# Altium project RC-XD(SRX).PrjPcb
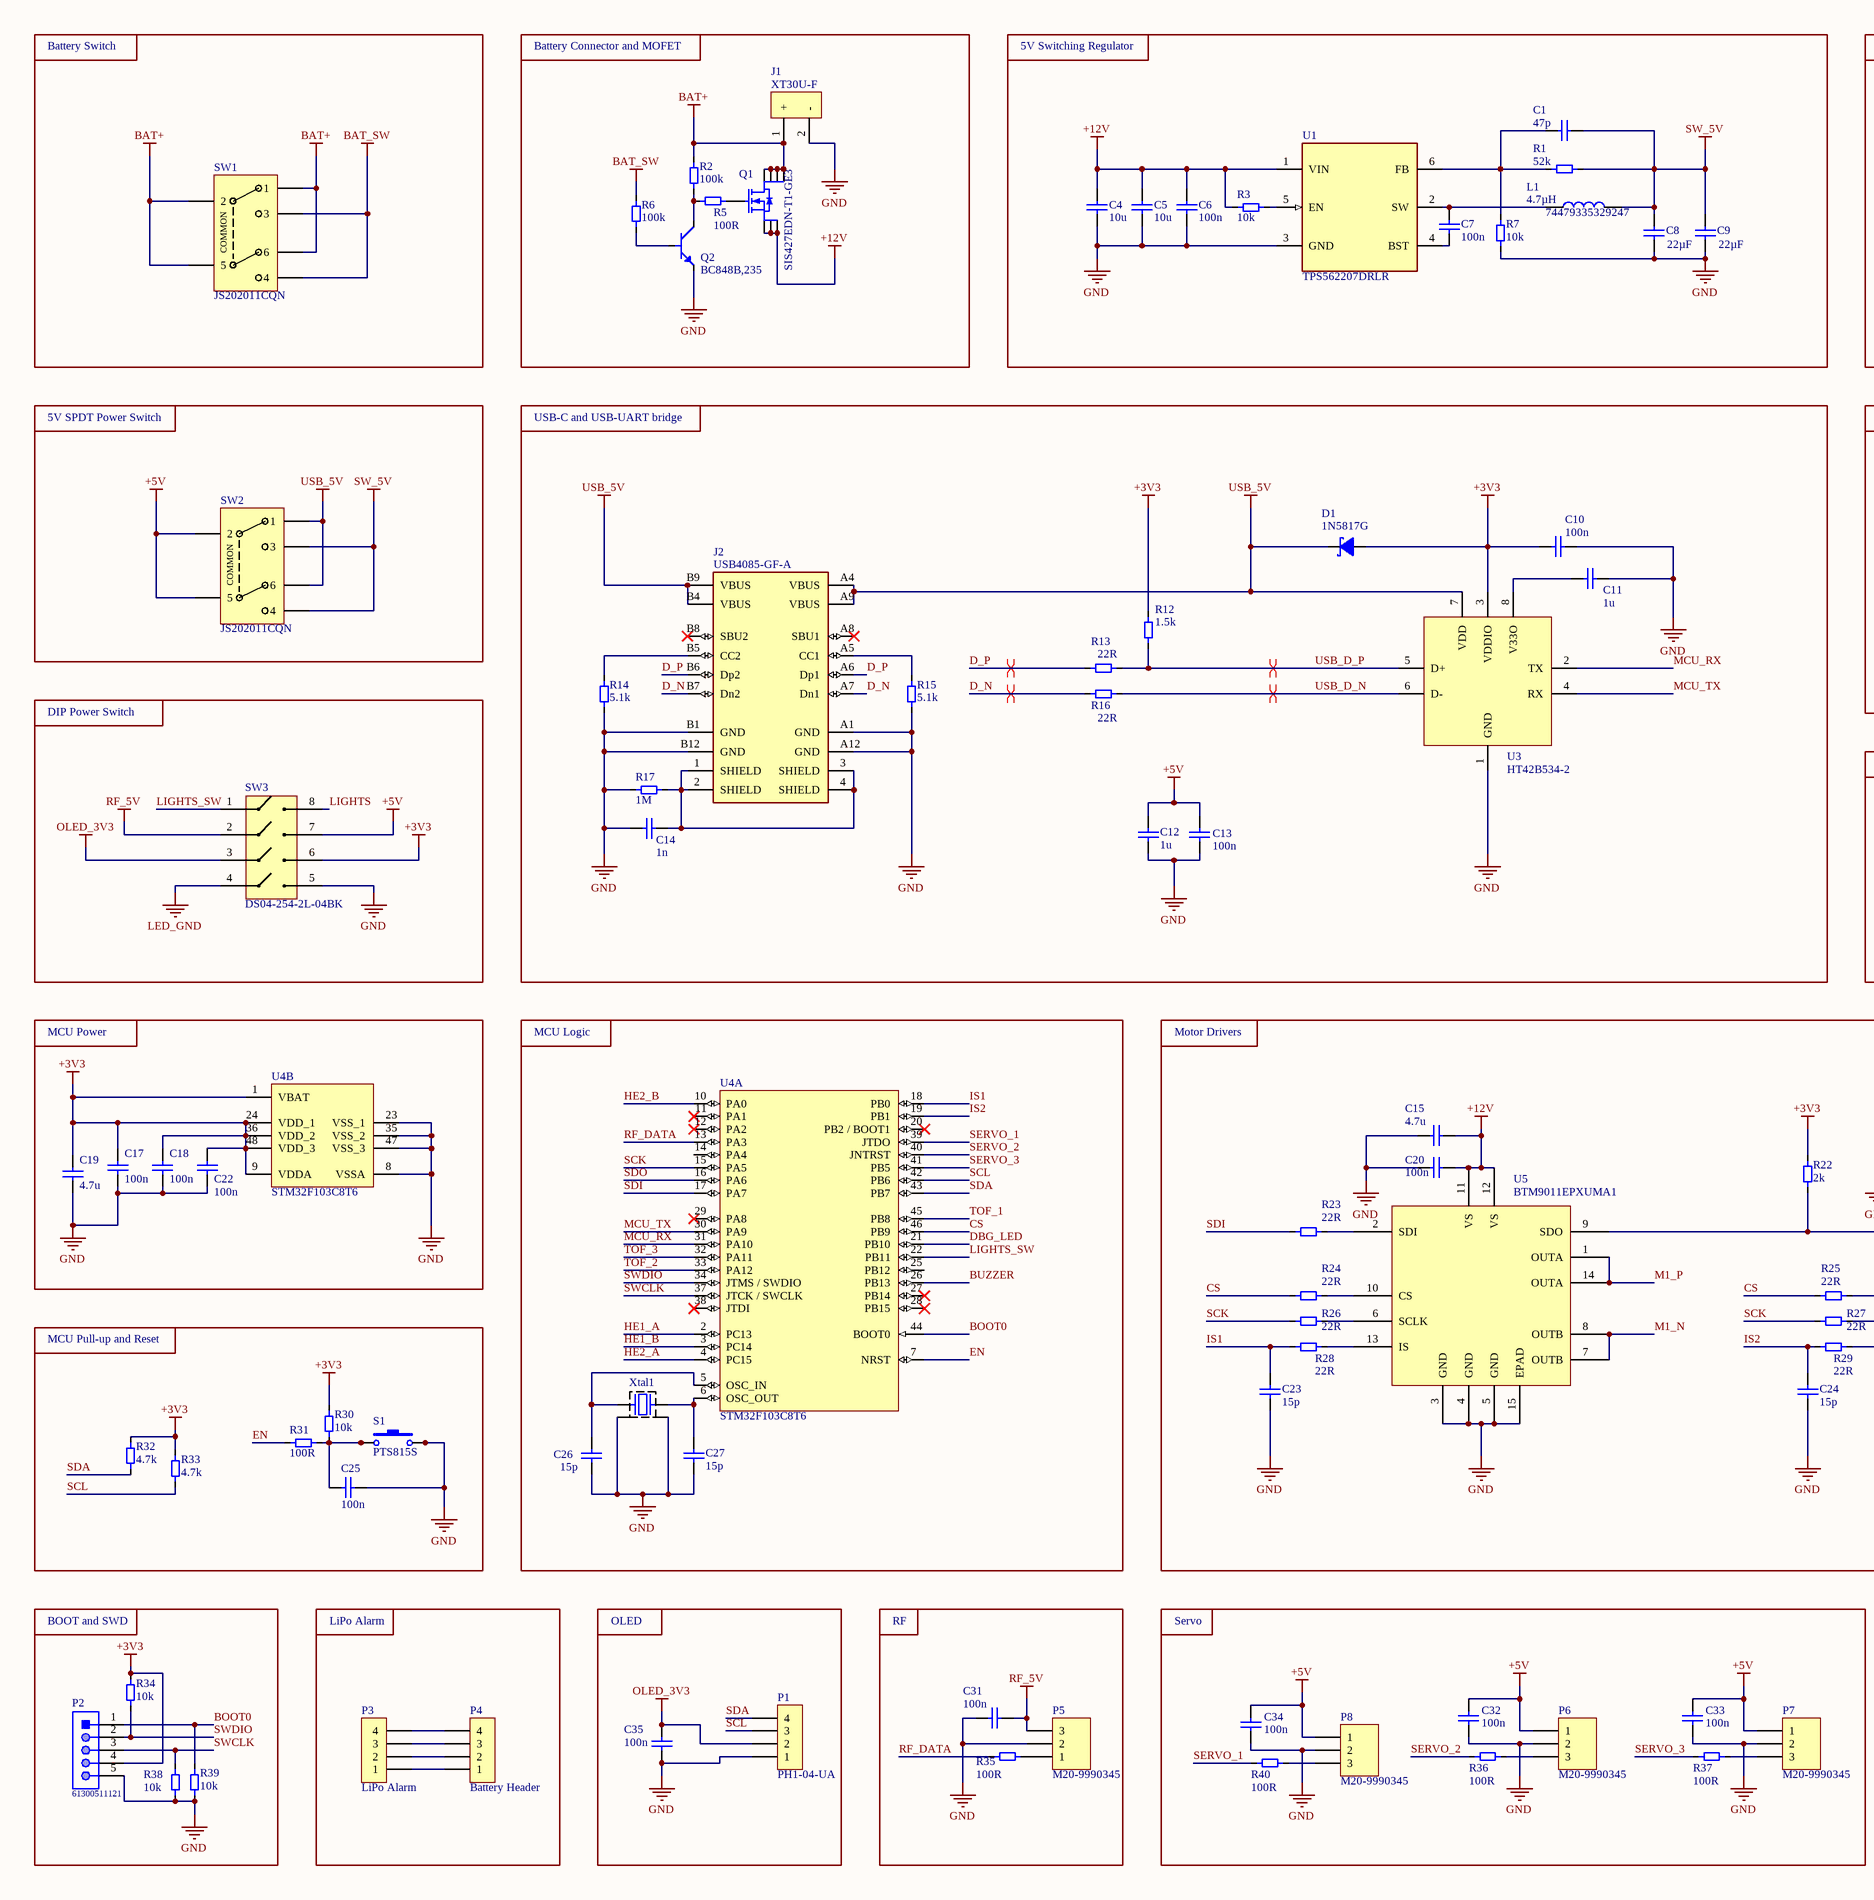
[diagram p0: SRX.SchDoc, left]
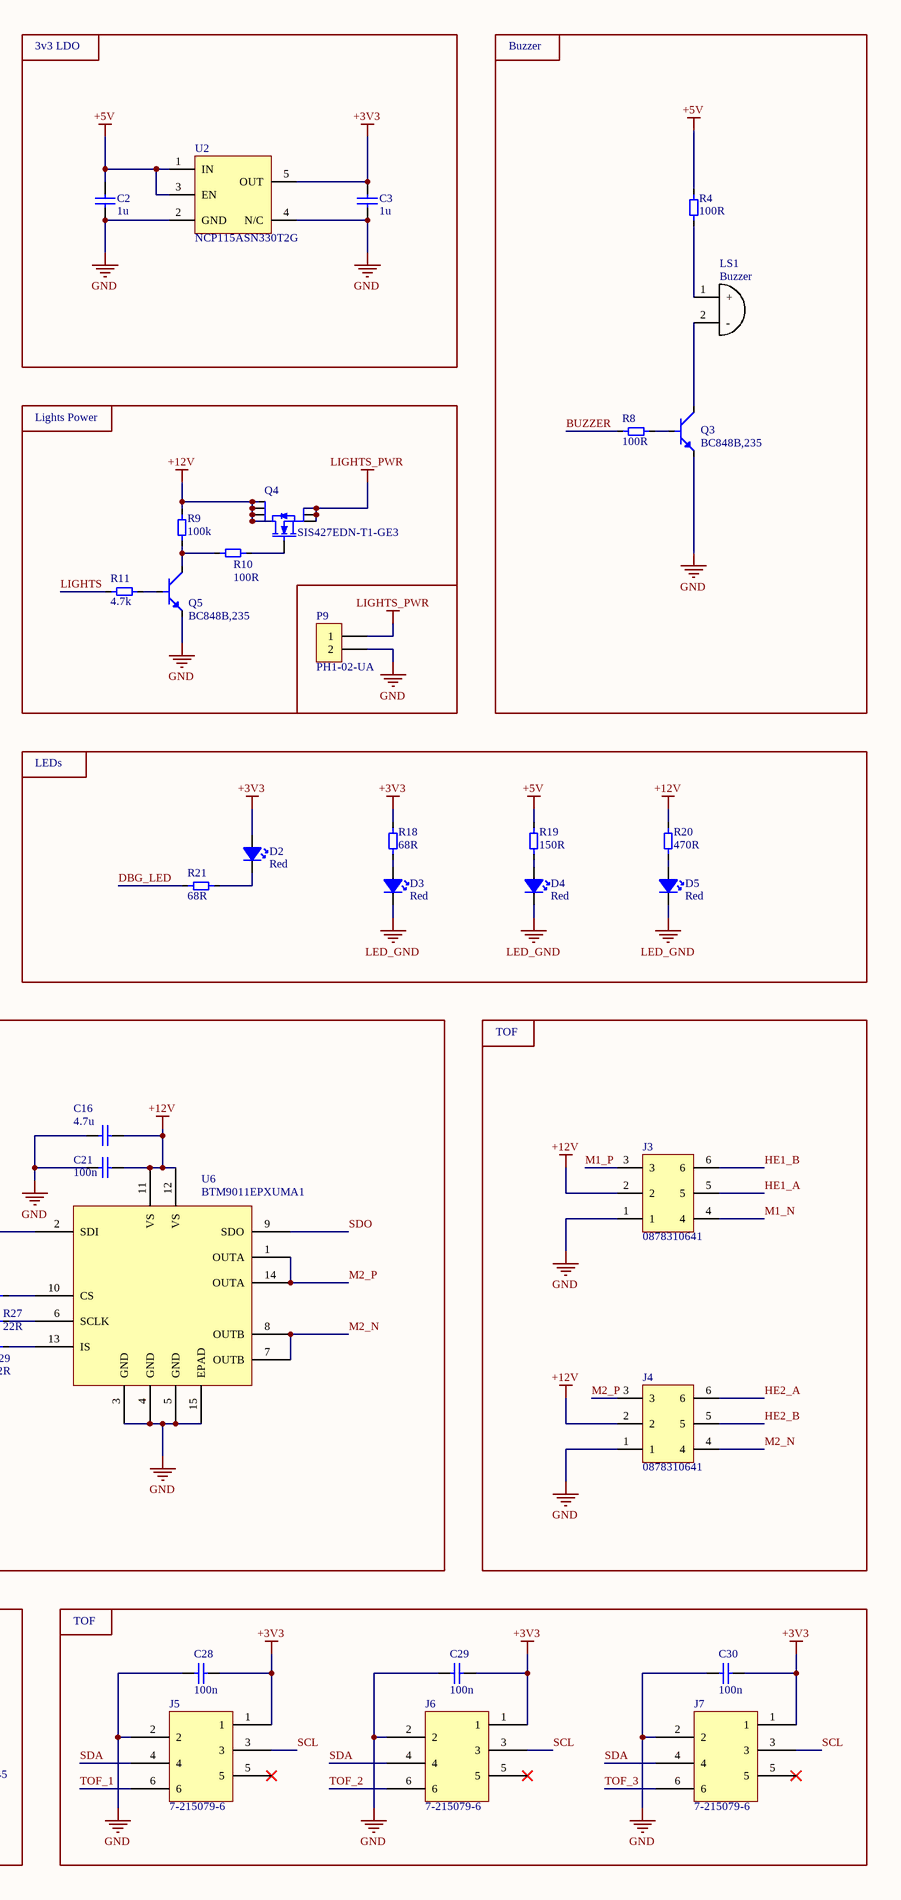
[diagram p1: SRX.SchDoc, right]
1 sheet, 114 parts. Net scope: global (net labels, ports and power ports of the same name join across sheets).
Board file: SRX.PcbDoc

## Sheet SRX.SchDoc
size A2; DocumentNumber: No here; SheetNumber: 1; SheetTotal: 1

### Parts
C1  47p  [MLCC_0603_M]
C2  1u  [MLCC_0603_M]
C3  1u  [MLCC_0603_M]
C4  10u  [MLCC_0805_M]
C5  10u  [MLCC_0805_M]
C6  100n  [MLCC_0603_M]
C7  100n  [MLCC_0603_M]
C8  value 22µF  [1210_MLCC]  (hidden comment: C1210C226K4PAC-TU)
C9  value 22µF  [1210_MLCC]  (hidden comment: C1210C226K4PAC-TU)
C10  100n  [MLCC_0603_M]
C11  1u  [MLCC_0603_M]
C12  1u  [MLCC_0603_M]
C13  100n  [MLCC_0603_M]
C14  1n  [MLCC_0603_M]
C15  4.7u  [MLCC_0603_M]
C16  4.7u  [MLCC_0603_M]
C17  100n  [MLCC_0603_M]
C18  100n  [MLCC_0603_M]
C19  4.7u  [MLCC_0805_M]
C20  100n  [MLCC_0603_M]
C21  100n  [MLCC_0603_M]
C22  100n  [MLCC_0603_M]
C23  15p  [MLCC_0603_M]
C24  15p  [MLCC_0603_M]
C25  100n  [MLCC_0603_M]
C26  15p  [MLCC_0402_M]
C27  15p  [MLCC_0402_M]
C28  100n  [MLCC_0603_M]
C29  100n  [MLCC_0603_M]
C30  100n  [MLCC_0603_M]
C31  100n  [MLCC_0603_M]
C32  100n  [MLCC_0603_M]
C33  100n  [MLCC_0603_M]
C34  100n  [MLCC_0603_M]
C35  100n  [MLCC_0603_M]
D1  1N5817G  [SOD-323 based on 1N5817WS]
D2  Red  [0603 RED LED]
D3  Red  [0603 RED LED]
D4  Red  [0603 RED LED]
D5  Red  [0603 RED LED]
J1  XT30U-F  [XT30U-F]
J2  USB4085-GF-A  [FP-USB4085-GF-A-MFG]
J3  0878310641  [0878310641]
J4  0878310641  [0878310641]
J5  7-215079-6  [7-215079-6-Footprint-1]
J6  7-215079-6  [7-215079-6-Footprint-1]
J7  7-215079-6  [7-215079-6-Footprint-1]
L1  74479335329247  value 4.7µH  [WE-PMFI_353220]
LS1  Buzzer  [Buzzer-Footprint-1]
P1  PH1-04-UA  [4Pos Pin Header Vertical]
P2  61300511121  [61300511121]
P3  LiPo Alarm  [4Pos Pin Header Vertical]
P4  Battery Header  [4Pos Pin Header Vertical]
P5  M20-9990345  [3Pos Pin Header]
P6  M20-9990345  [3Pos Pin Header]
P7  M20-9990345  [3Pos Pin Header]
P8  M20-9990345  [3Pos Pin Header]
P9  PH1-02-UA  [2Pos Pin Header Vertical]
Q1  SIS427EDN-T1-GE3  [Copy of TPN2R304PL,L1Q-Footprint-1]
Q2  BC848B,235  [SOT-23-3]
Q3  BC848B,235  [SOT-23-3]
Q4  SIS427EDN-T1-GE3  [Copy of TPN2R304PL,L1Q-Footprint-1]
Q5  BC848B,235  [SOT-23-3]
R1  52k  [Resistor_0603_M]
R2  100k  [Resistor_0603_M]
R3  10k  [Resistor_0603_M]
R4  100R  [Resistor_0603_M]
R5  100R  [Resistor_0603_M]
R6  100k  [Resistor_0603_M]
R7  10k  [Resistor_0603_M]
R8  100R  [Resistor_0603_M]
R9  100k  [Resistor_0603_M]
R10  100R  [Resistor_0603_M]
R11  4.7k  [Resistor_0603_M]
R12  1.5k  [Resistor_0603_M]
R13  22R  [Resistor_0603_M]
R14  5.1k  [Resistor_0603_M]
R15  5.1k  [Resistor_0603_M]
R16  22R  [Resistor_0603_M]
R17  1M  [Resistor_1206_M]
R18  68R  [Resistor_0603_M]
R19  150R  [Resistor_0603_M]
R20  470R  [Resistor_0603_M]
R21  68R  [Resistor_0603_M]
R22  2k  [Resistor_0603_M]
R23  22R  [Resistor_0603_M]
R24  22R  [Resistor_0603_M]
R25  22R  [Resistor_0603_M]
R26  22R  [Resistor_0603_M]
R27  22R  [Resistor_0603_M]
R28  22R  [Resistor_0603_M]
R29  22R  [Resistor_0603_M]
R30  10k  [Resistor_0603_M]
R31  100R  [Resistor_0603_M]
R32  4.7k  [Resistor_0603_M]
R33  4.7k  [Resistor_0603_M]
R34  10k  [Resistor_0603_M]
R35  100R  [Resistor_0603_M]
R36  100R  [Resistor_0603_M]
R37  100R  [Resistor_0603_M]
R38  10k  [Resistor_0603_M]
R39  10k  [Resistor_0603_M]
R40  100R  [Resistor_0603_M]
S1  PTS815S  [PTS815 SJM 250 SMTR LFS]
SW1  JS202011CQN  [FP-JS202011CQN-MFG]
SW2  JS202011CQN  [FP-JS202011CQN-MFG]
SW3  DS04-254-2L-04BK  [DS04-254-2L-04BK-Footprint-1]
U1  TPS562207DRLR  [FP-DRL0006A-MFG]
U2  NCP115ASN330T2G  [TSOP-5]
U3  HT42B534-2  [SOP-8 150mil]
U4  STM32F103C8T6  [STM-LQFP48_M]  (parts A,B of 2)
U5  BTM9011EPXUMA1  [BTM9011EPXUMA1]
U6  BTM9011EPXUMA1  [BTM9011EPXUMA1]
Xtal1  ABM11-16.000MHZ-12-N1G-T  [FP-ABM11-MFG]  (value not drawn)

### Blocks framed on the sheet
Battery Switch: SW1
Battery Connector and MOFET: J1 Q1 Q2 R2 R5 R6
5V Switching Regulator: C1 C4-C9 L1 R1 R3 R7 U1
3v3 LDO: C2 C3 U2
Buzzer: LS1 Q3 R4 R8
5V SPDT Power Switch: SW2
USB-C and USB-UART bridge: C10-C14 D1 J2 R12-R17 U3
Lights Power: P9 Q4 Q5 R9-R11
DIP Power Switch: SW3
LEDs: D2-D5 R18-R21
MCU Power: C17-C19 C22 U4
MCU Logic: C26 C27 U4 Xtal1
Motor Drivers: C15 C16 C20 C21 C23 C24 R22-R29 U5 U6
TOF: J3 J4
MCU Pull-up and Reset: C25 R30-R33 S1
BOOT and SWD: P2 R34 R38 R39
LiPo Alarm: P3 P4
OLED: C35 P1
RF: C31 P5 R35
Servo: C32-C34 P6-P8 R36 R37 R40
TOF: C28-C30 J5-J7

### Nets
+3V3: C3.2 C10.1 C17.1 C18.1 C19.2 C22.1 C28.1 C29.1 C30.1 D1.2(A) D2.2(A) J5.1 J6.1 J7.1 P2.4 R12.2 R18.2 R22.2 R30.2 R32.2 R33.2 R34.1 SW3.6 U2.5(OUT) U3.3(VDDIO) U4.1(VBAT) U4.9(VDDA) U4.24(VDD_1) U4.36(VDD_2) U4.48(VDD_3)
+5V: C2.2 C12.2 C13.1 C32.1 C33.1 C34.1 P6.1 P7.1 P8.1 R4.1 R19.1 SW2.2 SW2.5 SW3.7 U2.1(IN) U2.3(EN)
+12V: C4.2 C5.2 C6.2 C15.2 C16.2 C20.2 C21.2 J3.2 J4.2 Q1.1(S) Q1.2(S) Q1.3(S) Q4.5(D) Q4.6(D) Q4.7(D) Q4.8(D) R3.1 R9.2 R20.2 U1.1(VIN) U5.11(VS) U5.12(VS) U6.11(VS) U6.12(VS)
BAT+: J1.1(+) Q1.5(D) Q1.6(D) Q1.7(D) Q1.8(D) R2.2 SW1.1 SW1.2 SW1.5 SW1.6
BAT_SW: R6.2 SW1.3 SW1.4
GND: C2.1 C3.1 C4.1 C5.1 C6.1 C8.1 C9.1 C10.2 C11.2 C12.1 C13.2 C14.1 C15.1 C16.1 C17.2 C18.2 C19.1 C20.1 C21.1 C22.2 C23.2 C24.2 C25.1 C26.1 C27.1 C28.2 C29.2 C30.2 C31.2 C32.2 C33.2 C34.2 C35.2 J1.2(-) J2.A1(GND) J2.A12(GND) J2.B1(GND) J2.B12(GND) J3.1 J4.1 J5.2 J6.2 J7.2 P1.1 P2.5 P5.2 P6.2 P7.2 P8.2 P9.2 Q2.2(E) Q3.2(E) Q5.2(E) R7.1 R14.1 R15.2 R17.2 R38.1 R39.1 S1.3 S1.4 SW3.5 U1.3(GND) U2.2(GND) U2.4(N/C) U3.1(GND) U4.8(VSSA) U4.23(VSS_1) U4.35(VSS_2) U4.47(VSS_3) U5.3(GND) U5.4(GND) U5.5(GND) U5.15(EPAD) U6.3(GND) U6.4(GND) U6.5(GND) U6.15(EPAD) Xtal1.2 Xtal1.4
LED_GND: D3.1(C) D4.1(C) D5.1(C) SW3.4
LIGHTS_PWR: P9.1 Q4.1(S) Q4.2(S) Q4.3(S)
OLED_3V3: C35.1 P1.2 SW3.3
RF_5V: C31.1 P5.3 SW3.2
SW_5V: C1.2 C8.2 C9.2 L1.2 R1.2 SW2.3 SW2.4
USB_5V: D1.1(C) J2.A4(VBUS) J2.A9(VBUS) J2.B4(VBUS) J2.B9(VBUS) SW2.1 SW2.6 U3.7(VDD)
BOOT0: P2.1 R39.2 U4.44(BOOT0)
BUZZER: R8.1 U4.26(PB13)
CS: R24.1 R25.1 U4.46(PB9)
D_N: J2.A7(Dn1) J2.B7(Dn2) R16.1
D_P: J2.A6(Dp1) J2.B6(Dp2) R13.1
DBG_LED: R21.2 U4.21(PB10)
EN: R31.2 U4.7(NRST)
HE1_A: J3.5 U4.2(PC13)
HE1_B: J3.6 U4.3(PC14)
HE2_A: J4.6 U4.4(PC15)
HE2_B: J4.5 U4.10(PA0)
IS1: C23.1 R28.1 U4.18(PB0)
IS2: C24.1 R29.1 U4.19(PB1)
LIGHTS: R11.2 SW3.8
LIGHTS_SW: SW3.1 U4.22(PB11)
M1_N: J3.4 U5.7(OUTB) U5.8(OUTB)
M1_P: J3.3 U5.1(OUTA) U5.14(OUTA)
M2_N: J4.4 U6.7(OUTB) U6.8(OUTB)
M2_P: J4.3 U6.1(OUTA) U6.14(OUTA)
MCU_RX: U3.2(TX) U4.31(PA10)
MCU_TX: U3.4(RX) U4.30(PA9)
RF_DATA: R35.1 U4.13(PA3)
SCK: R26.1 R27.1 U4.15(PA5)
SCL: J5.3 J6.3 J7.3 P1.3 R33.1 U4.42(PB6)
SDA: J5.4 J6.4 J7.4 P1.4 R32.1 U4.43(PB7)
SDI: R23.1 U4.17(PA7)
SDO: U4.16(PA6) U6.9(SDO)
SERVO_1: R40.2 U4.39(JTDO)
SERVO_2: R36.2 U4.40(JNTRST)
SERVO_3: R37.2 U4.41(PB5)
SWCLK: P2.3 R38.2 U4.37(JTCK_/_SWCLK)
SWDIO: P2.2 R34.2 U4.34(JTMS_/_SWDIO)
TOF_1: J5.6 U4.45(PB8)
TOF_2: J6.6 U4.33(PA12)
TOF_3: J7.6 U4.32(PA11)
USB_D_N: R16.2 U3.6(D-)
USB_D_P: R12.1 R13.2 U3.5(D+)
NetC1_1: C1.1 R1.1 R7.2 U1.6(FB)
NetC7_1: C7.1 U1.4(BST)
NetC7_2: C7.2 L1.1 U1.2(SW)
NetC11_1: C11.1 U3.8(V33O)
NetC14_2: C14.2 J2.1(SHIELD) J2.2(SHIELD) J2.3(SHIELD) J2.4(SHIELD) R17.1
NetC25_2: C25.2 R30.1 R31.1 S1.1 S1.2
NetC26_2: C26.2 U4.5(OSC_IN) Xtal1.1
NetC27_2: C27.2 U4.6(OSC_OUT) Xtal1.3
NetD2_1: D2.1(C) R21.1
NetD3_2: D3.2(A) R18.1
NetD4_2: D4.2(A) R19.2
NetD5_2: D5.2(A) R20.1
NetJ2_A5: J2.A5(CC1) R15.1
NetJ2_B5: J2.B5(CC2) R14.2
NetLS1_1: LS1.1(+) R4.2
NetLS1_2: LS1.2(-) Q3.3(C)
NetP3_1: P3.1 P4.1
NetP3_2: P3.2 P4.2
NetP3_3: P3.3 P4.3
NetP3_4: P3.4 P4.4
NetP5_1: P5.1 R35.2
NetP6_3: P6.3 R36.1
NetP7_3: P7.3 R37.1
NetP8_3: P8.3 R40.1
NetQ1_4: Q1.4(G) R5.1
NetQ2_1: Q2.1(B) R6.1
NetQ2_3: Q2.3(C) R2.1 R5.2
NetQ3_1: Q3.1(B) R8.2
NetQ4_4: Q4.4(G) R10.1
NetQ5_1: Q5.1(B) R11.1
NetQ5_3: Q5.3(C) R9.1 R10.2
NetR3_2: R3.2 U1.5(EN)
NetR22_1: R22.1 U5.9(SDO) U6.2(SDI)
NetR23_2: R23.2 U5.2(SDI)
NetR24_2: R24.2 U5.10(CS)
NetR25_2: R25.2 U6.10(CS)
NetR26_2: R26.2 U5.6(SCLK)
NetR27_2: R27.2 U6.6(SCLK)
NetR28_2: R28.2 U5.13(IS)
NetR29_2: R29.2 U6.13(IS)

Not connected (* = marked no-connect by the designer): J2 A8(SBU1)* B8(SBU2)*; J5 5*; J6 5*; J7 5*; U4 11(PA1)* 12(PA2)* 14(PA4) 20(PB2_/_BOOT1)* 25(PB12) 27(PB14)* 28(PB15)* 29(PA8)* 38(JTDI)*

### Layout directives
differential pair: D_N, D_P, USB_D_N, USB_D_P

### Notes on the sheet
- Title:
- Revision:
- Date:
- Size:
- A2
- Sheet:
- of
- Variant:
- Project:
- Revision R&D:
- Last modified:
- Checked By:
- This document and its contents are the property of =GlobalCompanyName . Any unauthorized reproduction, distribution, or disclosure to third parties of this document or its contents, in whole or in part, without prior written agreement from =GlobalCompanyName is strictly prohibited and may be subject to legal action.
- (in symbol CMP-ROOT-01260-4) COMMON

### Library data of the parts
C1 = CMP-001-0765-1: MLCC, 0603, 47p, 10%, 50V, X7R; Manufacturer: Any; Capacitor Type: Ceramic; Value: 47pF; Dielectric: X7R; RoHS: Yes; Mount: SMD; Case/Package: 0603; Part number: MLCC, 0603, 47p, 10%, 50V, X7R; Tolerance: 10%; Voltage: 50V
C2 C3 C11 C12 = CMP-001-0565-1: MLCC, 0603, 1u, 10%, 50V, X5R; Manufacturer: Any; Capacitor Type: Ceramic; Value: 1µF; Part number: MLCC, 0603, 1u, 10%, 50V, X5R; Dielectric: X5R; Voltage: 50V; RoHS: Yes; Tolerance: 10%; Mount: SMD; Case/Package: 0603
C4 C5 = CMP-001-0829-2: MLCC, 0805, 10u, 10%, 50V, X5R; Manufacturer: Any; Value: 10µF; Capacitor Type: Ceramic; RoHS: Yes; Tolerance: 10%; Voltage: 50V; Mount: SMD; Case/Package: 0805; Part number: MLCC, 0805, 10u, 10%, 50V, X5R; Dielectric: X5R
C6 C7 C10 C13 C17 C18 C22 C25 C28-C35 = CMP-001-0815-1: MLCC, 0603, 100n, 10%, 50V, X7R; Manufacturer: Any; Value: 100nF; Capacitor Type: Ceramic; Part number: MLCC, 0603, 100n, 10%, 50V, X7R; RoHS: Yes; Dielectric: X7R; Mount: SMD; Voltage: 50V; Tolerance: 10%; Case/Package: 0603
C8 C9 = CMP-001-1351-1: Capacitor;  Ceramic;  22uF;  Tol+10%;  SMT HighCapacitance;  16V;  X5R;  TR; Part number: Any; Tolerance: 10%; Radiation Hardening: No; Dielectric: X5R; Min Operating Temperature: -55°C; Package Quantity: 2000; Length: 3.2mm; Height: 1.85mm; RoHS: Yes; Capacitance: 22uF; REACH SVHC: No SVHC; Depth: 2.5mm; Case Code (Imperial): 1210; Voltage Rating (DC): 16V; Termination: SMD/SMT; Voltage: 16V; Voltage Rating: 16V; Mount: Surface Mount,PCB; Case/Package: 1210; Case Code (Metric): 3225; Width: 2.5mm; Dielectric Material: Ceramic; Capacitor Type: Ceramic; Number of Pins: 2; Thickness: 0.11inch; Max Operating Temperature: 85°C; Packaging: Tape and Reel; Manufacturer: Any
C14 = CMP-001-0547-1: MLCC, 0603, 1n, 10%, 50V, X5R; Manufacturer: Any; Capacitor Type: Ceramic; Value: 1nF; Case/Package: 0603; Part number: MLCC, 0603, 1n, 10%, 50V, X5R; RoHS: Yes; Dielectric: X5R; Mount: SMD; Tolerance: 10%; Voltage: 50V
C15 C16 = CMP-001-1257-1: MLCC, 0603, 4.7u, 10%, 35V, X5R; Manufacturer: Any; Value: 4,7µF; Capacitor Type: Ceramic; Dielectric: X5R; Tolerance: 10%; Voltage: 35V; Part number: MLCC, 0603, 4.7u, 10%, 35V, X5R; Case/Package: 0603; Mount: SMD; RoHS: Yes
C19 = CMP-001-1830-1: MLCC, 0805, 4.7u, 20%, 50V, X5R; Manufacturer: Any; Capacitor Type: Ceramic; Value: 4.7µF; Mount: SMD; Case/Package: 0805; Dielectric: X5R; RoHS: Yes; Part number: MLCC, 0805, 4.7u, 20%, 50V, X5R; Voltage: 50V; Tolerance: 20%
C20 C21 = CMP-001-0755-1: MLCC, 0603, 100n, 10%, 35V, X7R; Manufacturer: Any; Capacitor Type: Ceramic; Value: 100nF; Voltage: 35V; Case/Package: 0603; Part number: MLCC, 0603, 100n, 10%, 35V, X7R; RoHS: Yes; Tolerance: 10%; Dielectric: X7R; Mount: SMD
C23 C24 = CMP-001-0474-1: MLCC, 0603, 15p, 5%, 50V, C0G/NP0; Manufacturer: Any; Value: 15pF; Capacitor Type: Ceramic; Dielectric: C0G/NP0; Case/Package: 0603; Part number: MLCC, 0603, 15p, 5%, 50V, C0G/NP0; Voltage: 50V; Mount: SMD; RoHS: Yes; Tolerance: 5%
C26 C27 = CMP-001-1853-1: MLCC, 0402, 15p, 10%, 25V, C0G/NP0; Manufacturer: Any; Capacitor Type: Ceramic; Voltage Rating: 25; Value: 15pF; Dielectric: C0G; Temperature Coefficient: 300ppm/°C; Height: 0.5mm; Width: 0.02inch; Contact Plating: Tin; Package Quantity: 1; Case/Package: 0402; Depth: 0.5mm; Material: Ceramic; Packaging: Tape and Reel; Radiation Hardening: No; Case Code (Imperial): 0402; Min Operating Temperature: -55°C; Mount: Surface Mount; RoHS: Yes; Length: 1mm; Thickness: 0.022inch; Part number: MLCC, 0402, 15p, 10%, 25V, C0G/NP0; Capacitance: 15pF; Tolerance: 10%; Case Code (Metric): 1005; Voltage: 25V; Max Operating Temperature: 125°C
D1 = CMP-ROOT-01323-1: Rectifier Diode, Schottky, 1 Phase, 1 Element, 1A, 20V V(RRM), Silicon, DO-204AL; Manufacturer: TWGMC / onsemi; Part number: 1N5817WS; Manufacturer Lifecycle Status: ACTIVE; Element Configuration: Single; Forward Voltage: 320mV; Max Forward Surge Current (Ifsm): 25A; Number of Elements: 1; Peak Reverse Current: 1mA; Polarity: Standard; Case/Package: Axial; Mount: SMD; Pins: 2; RoHS: Compliant; Average Rectified Current: 1A; Breakdown Voltage: 20V; China RoHS: Non-Compliant; Country of Origin: Mainland China; Current Rating: 1A; Diameter: 2.7mm; Export Control Classification Number (ECCN) Code: EAR99; Forward Current: 1A; Halogen Free: Halogen Free; Harmonized Tariff Schedule (HTS) Code: 8541.10.00.80; Height: 2.7mm; Introduction Date: 1997-05-06; Lead Free: Lead Free; Length: 5.1816mm; Lifecycle Status: Production; Max Operating Temperature: 125°C; Max Output current: 1A; Max Repetitive Reverse Voltage (Vrrm): 20V; Max Reverse Voltage (DC): 20V; Min Operating Temperature: -65°C; Number of Terminals: 2; Output Current: 1A; Packaging: Bulk; Peak Non-Repetitive Surge Current: 25A; REACH SVHC: No; Radiation Hardening: No; Reverse Standoff Voltage: 20V; Schedule B: 8541100080, 8541100080; Voltage Rating (DC): 20V; Weight: 4.535924g; Width: 2.7mm
D2-D5 = CMP-ROOT-00025-2: Generic red 0603 LED; Part number: Any Red 0603 LED; Manufacturer: Any; Color: Red; Case/Package: 0603; Mount: SMD; RoHS: Yes
J1 = CMP-ROOT-01262-4: Power Connector; Manufacturer: AMASS; Case/Package: Non-standard; Mount: SMD; Part number: XT30U-F; Pins: 2; RoHS: Yes; Color: Yellow; Contact Material: Brass; Orientation: Straight
J2 = CMP-001-1800-1: USB Connector, 16 Contact(s), Female, Right Angle, Solder Terminal, Locking, Receptacle; Manufacturer: GCT; Part number: USB4800-03-A; USB Standard: USB 2.0; Standoff Height: 3.5mm; USB PD: 3.2; Current Rating: 4.25A; Mating Cycles: 10000; Number of Contacts: 16; Number of Ports: 1; Shielding: Shielded; Voltage Rating: 20V; RoHS: Yes; Pins: 16; Mount: TH; Connector Type: USB; Contact Material: Copper Alloy; Contact Plating: Gold; Flammability Rating: UL94 V-0; Gender: Receptacle; Height: 3.66mm; Insulation Color: Black; Max Operating Temperature: 85°C; Min Operating Temperature: -40°C; Mounting Technology: Through Hole,Horizontal; Number of Positions: 16; Orientation: Right Angle; Packaging: Tape and Reel; Series: USB4085; Termination: Solder
J3 J4 = CMP-ROOT-01318-3: Conn Shrouded Header (2 Sides) HDR 6 POS 2mm Solder ST Top Entry Thru-Hole Milli-Grid Tube; Manufacturer: Molex; Manufacturer Lifecycle Status: ACTIVE; Current Rating: 2A; Dielectric Material: Polyamide; Insulation Resistance: 1GΩ; Number of Circuits: 6; Operating Force: 1.9N; Plating: Tin; Plating Thickness: 762nm; Mount: TH; Part number: 0878310641; Pins: 6; RoHS: Compliant; China RoHS: Compliant; Contact Gender: Male; Contact Plating: Gold; Export Control Classification Number (ECCN) Code: EAR99; Harmonized Tariff Schedule (HTS) Code: 8536.69.40.40; Introduction Date: 2014-01-28; Lifecycle Status: Production; Max Operating Temperature: 105°C; Min Operating Temperature: -55°C; Number of Rows: 2; Orientation: Vertical; REACH SVHC: Yes; Row Spacing: 2mm; Schedule B: 8536694040, 8536694040; Terminal Pitch: 2mm
J5-J7 = CMP-ROOT-01311-2: Conn FFC Connector F 6 POS 1.27mm Solder ST Thru-Hole Automotive Box/Carton; Manufacturer: TE Connectivity; Manufacturer Lifecycle Status: ACTIVE; Contact Current Rating: 1A; Contact Resistance: 10mΩ; Insulation Resistance: 1GΩ; Mating Connector Lock: Without; Number of Contacts: 6; Number of Ports: 1; Operating Force: 4.8928N; Operating Supply Voltage: 100V; PCB Mount Retention: With; Plating Thickness: 4.99999µm; Row Spacing: 2.54mm; Shielding: No; Mount: TH; Part number: 7-215079-6; Pins: 6; RoHS: Compliant; China RoHS: Compliant; Color: Red; Contact Gender: Female; Contact Material: Nickel, Tin; Contact Plating: Tin; Current Rating: 1A; Height: 4.2mm; Housing Color: Red; Insulation Material: Thermoplastic; Lead Free: Lead Free; Lead Pitch: 1.27mm; Length: 9.7mm; Lifecycle Status: Production; Max Operating Temperature: 105°C; Min Operating Temperature: -40°C; Mounting Technology: Through Hole; Number of Positions: 6; Number of Rows: 2; Orientation: Vertical; Packaging: Box; REACH SVHC: Yes; Terminal Pitch: 1.27mm; Voltage Rating: 100V; Voltage Rating (DC): 100V
L1 = CMP-ROOT-01341-1: Power Inductor, 4.7Uh, 3.85A, Shielded Rohs Compliant: Yes; Manufacturer: Wurth Elektronik; Manufacturer Lifecycle Status: NEW; DC Resistance (DCR): 63.2mΩ; Saturation Current: 3.2A; YEOL: 1 = Estimated lifetime > 10 years; Case/Package: 3.5 mm x 3.2 mm; Mount: SMD; Part number: 74479335329247; RoHS: Compliant; Ambient Temperature Range High: 110°C; Ambient Temperature Range Low: -55°C; Height: 2mm; Length: 3.5mm; Lifecycle Status: New; Max Operating Temperature: 150°C; Min Operating Temperature: -55°C; Mounting Technology: Surface Mount; Width: 3.2mm
LS1 = CMP-ROOT-01315-3: 7mm; Manufacturer: Unknown; Case/Package: Nonstandard; Mount: TH; Part number: Unknown; Pins: 2; RoHS: Yes
P1 = CMP-002-000004-1: 4 POS 2.54mm Vertical THT Header; Manufacturer: Adam Tech; Number of Positions: 4; Pins: 4; RoHS: Yes; Part number: PH1-04-UA; Mount: TH; Lead Free: Lead Free; Pitch: 2.54mm; Termination: Through Hole
P2 = CMP-ROOT-01020-1: Conn Unshrouded Header HDR 5 POS 2.54mm Solder ST Top Entry Thru-Hole Bag; Manufacturer: Wurth; Mount: TH; Part number: 61300511121; RoHS: Yes
P3 P4 = CMP-002-000004-1: 4 POS 2.54mm Vertical THT Header; Part number: PH1-04-UA; Manufacturer: Adam Tech; Number of Positions: 4; Pins: 4; RoHS: Yes; Mount: TH; Lead Free: Lead Free; Pitch: 2.54mm; Termination: Through Hole
P5-P8 = CMP-ROOT-00217-1: Connector Header Through Hole 3 position 0.100" (2.54mm); Manufacturer: Harwin Inc.; Insulation Resistance: 10GR; Number of Positions: 3; Voltage Rating (AC): 750V; Max Current Rating: 3A; Contact Resistance: 25mR; Connector Type: Male Pin; Min Operating Temperature: -40°C; Contact Material: Brass,Bronze; Package Quantity: 1000; Housing Material: Nylon; Contact Plating: Gold; Contact Mating Length: 0.24inch; Pitch: 2.54mm; Number of Rows: 1; REACH SVHC: No SVHC; Packaging: Bulk; Housing Color: Black; Width: 0.25inch; Number of Contacts: 3; Pins: 3; Mount: Through Hole; Radiation Hardening: No; RoHS: Yes; Weight: 0.006138oz; Depth: 2.54mm; Color: Black; Part number: M20-9990345; Case/Package: SIL; Termination: Solder; Max Operating Temperature: 105°C; Current Rating: 3A; Length: 7.62mm; Height: 0.125inch; Orientation: Straight
P9 = CMP-002-000007-1: Conn Unshrouded Header HDR 2 POS 2.54mm Solder ST Top Entry Thru-Hole Bag; Part number: PH1-04-UA; Manufacturer: Adam Tech; Number of Positions: 2; Contact Resistance: 20mΩ; Current Rating: 3A; Insulation Resistance: 5GΩ; Voltage Rating: 250V; Pins: 2; RoHS: Compliant; Mount: TH; Lead Free: Lead Free; Pitch: 2.54mm; Termination: Solder; Contact Gender: Male; Contact Material: Brass; Contact Plating: Gold; Height: 9.2456mm; Housing Material: PBT; Lifecycle Status: Production; Number of Contacts: 2; Number of Rows: 1; REACH SVHC: Yes; Schedule B: 8536694040, 8536694040; Terminal Pitch: 2.54mm
Q1 Q4 = CMP-ROOT-01317-1: Trans MOSFET P-CH 30V 15A 8-Pin PowerPAK EP T/R; Manufacturer: Vishay Siliconix; Continuous Drain Current (ID): 50A; Drain to Source Breakdown Voltage: -30V; Drain to Source Resistance: 10.6mΩ; Element Configuration: Single; Fall Time: 12ns; Gate to Source Voltage (Vgs): 25V; Input Capacitance: 1.93nF; Max Power Dissipation: 52W; Number of Channels: 1; Rise Time: 40ns; Turn-Off Delay Time: 28ns; Turn-On Delay Time: 45ns; Case/Package: PowerPAK® 1212-8; Mount: SMD; Part number: SIS427EDN-T1-GE3; Pins: 8; RoHS: Compliant; Drain to Source Voltage (Vdss): 30V; Export Control Classification Number (ECCN) Code: EAR99; Introduction Date: 2013-06-25; Lifecycle Status: Production; Max Operating Temperature: 150°C; Min Breakdown Voltage: 30V; Min Operating Temperature: -55°C; Mounting Technology: Surface Mount; Number of Elements: 1; Number of Terminals: 5; REACH SVHC: Unknown; Radiation Hardening: No; Rds On Max: 10.6mΩ; Schedule B: 8541290080
Q2 Q3 Q5 = CMP-ROOT-01328-1: Small Signal Bipolar Transistor, 0.1A I(C), 30V V(BR)CEO, 1-Element, NPN, Silicon, TO-236AB; Manufacturer: Nexperia; Manufacturer Lifecycle Status: RELEASED FOR SUPPLY; Collector Emitter Saturation Voltage: 600mV; Element Configuration: Single; Emitter Base Voltage (VEBO): 5V; Frequency: 100MHz; Max Collector Current: 100mA; Max Power Dissipation: 250mW; Number of Elements: 1; hFE Min: 200; Case/Package: SOT-23; Mount: SMD; Part number: BC848B,235; Pins: 3; RoHS: Compliant; China RoHS: Compliant; Collector Base Voltage (VCBO): 30V; Collector Emitter Breakdown Voltage: 30V; Collector Emitter Voltage (VCEO): 30V; Contact Plating: Tin; Gain Bandwidth Product: 100MHz; Lifecycle Status: Production; Max Operating Temperature: 150°C; Min Operating Temperature: -65°C; Mounting Technology: Surface Mount; Number of Terminals: 3; Polarity: NPN; Power Dissipation: 250mW; REACH SVHC: Yes; Radiation Hardening: No; Transition Frequency: 100MHz
R1 = CMP-0001-00268-2: Resistor, 0603, 53.6k, 1%, 1/10W; Manufacturer: Any; Case/Package: 0603; Mount: SMD; Part number: Resistor, 0603, 53.6k, 1%, 1/10W; RoHS: Yes; Tolerance: 1%; Value: 53.6k
R2 R6 R9 = CMP-001-0125-2: Resistor, 0603, 100k, 1%, 1/10W; Manufacturer: Any; Power: 100mW; Tolerance: 1%; Part number: Resistor, 0603, 100k, 1%, 1/10W; Mount: SMD; RoHS: Yes; Case/Package: 0603; Value: 100k
R3 R7 R30 R34 R38 = CMP-001-0101-2: Resistor, 0603, 10k, 1%, 1/10W; Manufacturer: Any; Power: 100mW; Tolerance: 1%; Value: 10k; RoHS: Yes; Mount: SMD; Case/Package: 0603; Part number: Resistor, 0603, 10k, 1%, 1/10W
R4 R5 R8 R10 R31 R35-R37 R40 = CMP-001-0054-5: Resistor, 0603, 100R, 1%, 1/10W; Manufacturer: Any; Value: 100; Power: 100mW; Case/Package: 0603; Mount: SMD; Part number: Resistor, 0603, 100R, 1%, 1/10W; Tolerance: 1%; RoHS: Yes
R11 R32 R33 = CMP-001-0093-2: Resistor, 0603, 4.7k, 1%, 1/10W; Manufacturer: Any; Power: 100mW; Value: 4,7k; Part number: Resistor, 0603, 4.7k, 1%, 1/10W; Case/Package: 0603; RoHS: Yes; Tolerance: 1%; Mount: SMD
R12 = CMP-001-0081-2: Resistor, 0603, 1.5k, 1%, 1/10W; Manufacturer: Any; Power: 100mW; Value: 1,5k; Case/Package: 0603; Mount: SMD; RoHS: Yes; Part number: Resistor, 0603, 1.5k, 1%, 1/10W; Tolerance: 1%
R13 R16 R23-R29 = CMP-001-0038-3: Resistor, 0603, 22R, 1%, 1/10W; Manufacturer: Any; Value: 22; Power: 100mW; Part number: Resistor, 0603, 22R, 1%, 1/10W; Tolerance: 1%; Case/Package: 0603; Mount: SMD; RoHS: Yes
R14 R15 = CMP-001-0094-2: Resistor, 0603, 5.1k, 1%, 1/10W; Manufacturer: Any; Power: 100mW; Value: 5,1k; Case/Package: 0603; Part number: Resistor, 0603, 5.1k, 1%, 1/10W; Mount: SMD; Tolerance: 1%; RoHS: Yes
R17 = CMP-0001-00051-1: Resistor, 1206, 1M, 1%, 1/4W; Manufacturer: Any; Case/Package: 1206; RoHS: Yes; Value: 1M; Mount: SMD; Part number: Any
R18 = CMP-0001-00262-1: Resistor, 0603, 100R, ≤5%, ≥1/16W; Manufacturer: Any; Value: 100; Case/Package: 0603; Mount: SMD; Part number: Resistor, 0603, 100R, ≤5%, ≥1/16W; RoHS: Yes
R19 R21 = CMP-001-0060-2: Resistor, 0603, 200R, 1%, 1/10W; Manufacturer: Any; Value: 200; Power: 100mW; RoHS: Yes; Part number: Resistor, 0603, 200R, 1%, 1/10W; Mount: SMD; Tolerance: 1%; Case/Package: 0603
R20 = CMP-001-0074-3: Resistor, 0603, 680R, 1%, 1/10W; Manufacturer: Any; Power: 100mW; Value: 680; RoHS: Yes; Tolerance: 1%; Mount: SMD; Part number: Resistor, 0603, 680R, 1%, 1/10W; Case/Package: 0603
R22 = CMP-001-0084-2: Resistor, 0603, 2k, 1%, 1/10W; Manufacturer: Any; Power: 100mW; Mount: SMD; Value: 2k; RoHS: Yes; Case/Package: 0603; Part number: Resistor, 0603, 2k, 1%, 1/10W; Tolerance: 1%
R39 = CMP-0001-00257-1: Resistor, 0603, 10k, ≤5%, ≥1/16W; Manufacturer: Any; Case/Package: 0603; Mount: SMD; Part number: Resistor, 0603, 10k, ≤5%, ≥1/16W; RoHS: Yes; Value: 10k
S1 = CMP-ROOT-00712-3: Tactile Switches SWITCH TACTILE; Manufacturer: C&K; Case/Package: -; RoHS: Yes; Part number: PTS815 SJM 250 SMTR LFS; Mount: SMD
SW1 SW2 = CMP-ROOT-01260-4: Slide Switch, 1 Positions, Dpdt, Latched, 0.3A, 6Vdc, 6 Pcb Hole Cnt, Solder Terminal, Through; Manufacturer: C&K; Actuator Length: 2.0066mm; Actuator Material: Nylon; Contact Current Rating: 300mA; Contact Resistance: 70mΩ; Electrical Life: 5kcycles; Illumination Type: Non-Illuminated; Insulation Resistance: 100MΩ; Max Voltage Rating (DC): 6V; Number of Positions: 1; Switch Function: On-On; Switch Travel: 2mm; Case/Package: Non-standard; Mount: SMD; Part number: JS202011CQN; Pins: 6; RoHS: Compliant; Color: Black; Contact Plating: Silver; Current Rating: 300mA; Depth: 3.6mm; Flammability Rating: UL94 V-0; Height: 3.5mm; Housing Material: Nylon; Lead Free: Lead Free; Length: 9mm; Life (Cycles): 5kcycles; Lifecycle Status: Production; Max Current Rating: 300mA; Max Operating Temperature: 85°C; Min Operating Temperature: -40°C; Mounting Technology: Through Hole; Orientation: Vertical; Packaging: Bulk; REACH SVHC: Yes; Radiation Hardening: No; Terminal Material: Brass; Termination: PC Pins; Throw Configuration: DPDT; Voltage Rating (DC): 6V
SW3 = CMP-ROOT-01342-2: Switch DIP OFF ON SPST 4 Flat Slide 0.025A 24VDC PC Pins 2.54mm Thru-Hole Tube; Manufacturer: Same Sky; Contact Resistance: 100mΩ; Electrical Life: 2kcycles; Max Current Rating: 25mA; Max Voltage Rating (DC): 24V; Number of Circuits: 4; Number of Positions: 2; Case/Package: Nonstandard; Mount: THT; Part number: DS04-254-2L-04BK; Pins: 8; RoHS: Compliant; Actuating System: Flat; Color: Black, White; Contact Plating: Gold; Export Control Classification Number (ECCN) Code: EAR99; Harmonized Tariff Schedule (HTS) Code: 8536.50.70.00; Height: 3.66mm; Insulation Resistance: 100MΩ; Introduction Date: 2020-02-24; Length: 11.16mm; Lifecycle Status: Production; Max Operating Temperature: 85°C; Min Operating Temperature: -40°C; Mounting Technology: Through Hole; Pitch: 2.54mm; REACH SVHC: Yes; Schedule B: 8536509065, 8536509065; Switching Current: 25mA; Switching Voltage: 24V; Throw Configuration: SPST; Width: 6.2mm
U1 = CMP-00034-1: 4.3-V to 17-V input, 2-A synchronous buck converter in SOT563 6-SOT-5X3 -40 to 125; Manufacturer Lifecycle Status: ACTIVE; Manufacturer: Texas Instruments; Max Junction Temperature (Tj): 125°C; Max Supply Voltage: 17V; Min Supply Voltage: 4.3V; Nominal Supply Current: 590µA; Number of Channels: 1; Output Current: 2A; Switching Frequency: 580kHz; Height: 600µm; Length: 1.6mm; Lifecycle Status: Production; Max Operating Temperature: 125°C; Min Operating Temperature: -40°C; Number of Outputs: 1; Pins: 6; RoHS: Compliant; Thickness: 550µm; Topology: Buck; Width: 1.2mm; Case/Package: SOT-563-6; Mount: SMD; Part number: TPS562207DRLR
U2 = CMP-00026-2: LDO Regulator, 300 mA, Low Iq, High PSRR, High Accuracy 3.3V, TSOP5, Active Discharge, Normal Vout Slew-Rate; Manufacturer: onsemi; Accuracy: 1%; Dropout Voltage: 235mV; Max Supply Voltage: 5.5V; Max Junction Temperature (Tj): 85°C; Min Input Voltage: 3.8V; Min Supply Voltage: 1.7V; Nominal Supply Current: 50µA; Number of Channels: 1; Output Current: 300mA; Output Type: Fixed; Voltage Tolerance: 2%; China RoHS: Compliant; Height: 1.1mm; Height - Seated (Max): 1.1mm; Length: 3mm; Lifecycle Status: Production; Manufacturer Lifecycle Status: ACTIVE; Max Operating Temperature: 150°C; Number of Circuits: 1; Number of Outputs: 1; Number of Terminals: 5; Output Voltage: 3.3V; REACH SVHC: Yes; RoHS: Compliant; Schedule B: 8542390000, 8542390000; Terminal Pitch: 950µm; Width: 1.5mm; Case/Package: TSOP-5; Mount: SMD; Part number: NCP115ASN330T2G
U3 = CMP-00027-3: USB to UART 3Mbps USB 2.0 SOP-8 Interface Controllers RoHS; Manufacturer: HOLTEK; Harmonized Tariff Schedule (HTS) Code: 8542.31.00.30; Introduction Date: 2019-03-26; Lifecycle Status: NRND; Case/Package: SOP-8; Mount: SMD; Part number: HT42B534-2; Pins: 8; RoHS: Yes
U4 = CMP-00012-3: MCU 32-bit STM32F1 ARM Cortex M3 RISC 64KB Flash 2.5V/3.3V 48-Pin LQFP Tray; Manufacturer: STMicroelectronics; Manufacturer Package Identifier: ai14911d; Address Bus Width: 32b; Frequency: 72MHz; Interface: CAN, USB; Clock Frequency: 16MHz; Max Power Dissipation: 363mW; Max Supply Current: 50mA; Max Supply Voltage: 3.6V; Min Supply Voltage: 2V; Nominal Supply Current: 1.7µA; Number of A/D Converters: 2; Number of ADC Channels: 10; Number of I/Os: 37; Number of Programmable I/O: 48; Number of Timers/Counters: 4; Number of USART Channels: 3; Operating Supply Voltage: 3.3V; Oscillator Type: Internal; Peripherals: POR; RAM Size: 20kB; Watchdog Timer: Yes; ADC Channels (Resolution): 10-Ch 12-Bit; Density: 512kb; EEPROM Memory Size: 0B; Number of Bits: 32; Number of Interrupts: 16; Number of PWM Channels: 1; Case/Package: LQFP; China RoHS: Compliant; Core Architecture: ARM; Data Bus Width: 32b; Flash Memory Size: 64kB; Height: 1.45mm; Lead Free: Lead Free; Length: 7mm; Lifecycle Status: Production; Max Operating Temperature: 85°C; Memory Size: 64kB; Memory Format: FLASH; Min Operating Temperature: -40°C; Number of Channels: 10; Number of I2C Channels: 2; Pins: 48; Number of SPI Channels: 2; Number of Terminals: 48; REACH SVHC: Yes; Radiation Hardening: No; RoHS: Compliant; Schedule B: 8542310000; Terminal Pitch: 500µm; Width: 7mm; Mount: SMD; Part number: STM32F103C8T6; Height - Seated (Max): 1.6mm; Mounting Technology: Surface Mount; Termination: SMD/SMT
U5 U6 = CMP-00022-3: DC Mtr Drive, Brush, 150DEGC, TSSOPEP-14 Rohs Compliant: Yes; Manufacturer: Infineon Technologies; Current - Output: 9.2A; Voltage - Supply: 4.5V ~ 40V; Interface: SPI; Output configuration: Full bridge; Motor Type - AC, DC: Brushed DC; REACH SVHC: Yes; RoHS: Compliant; Voltage - Load: 4.5V ~ 40V; Operating Temperature: -40C ~ 150C; Case/Package: 14-TSSOP; Mount: SMD; Part number: BTM9011EPXUMA1
Xtal1 = CMP-ROOT-01254-3: Crystal 16MHz ±10ppm (Tol) ±15ppm (Stability) 12pF FUND 150Ohm 4-Pin Ultra Mini-CSMD T/R; Manufacturer: Abracon LLC; ESR (Equivalent Series Resistance): 150Ω; Frequency Tolerance: 0.001%; Case/Package: 4-SMD, No Lead; Mount: SMD; RoHS: Compliant; China RoHS: Compliant; Frequency: 16MHz; Frequency Stability: 15ppm; Height: 590µm; Length: 2mm; Lifecycle Status: Production; Load Capacitance: 12pF; Max Operating Temperature: 85°C; Min Operating Temperature: -30°C; Mounting Technology: Surface Mount; REACH SVHC: Yes; Schedule B: 8541600080; ESR: 150Ω; Tolerance: 0.001%; Width: 1.6mm